# Altium schematic sheet 14.RK3588_USB30_USB20_Ctrl.SchDoc
size 420 x 297 mm; Revision: V2.1; Schematic Page Number: 11; Page Number: 14; Check: <Checker>; Schematic Name: RK_NVR_DEMO1_RK3588_LP4/4x_V21; Page Count: 43; Page name: 14.RK3588_USB30/USB20_Ctrl; Designer: Zhangdz; Schematic Page Count: 99; Revcode: V2.1; DsnPath: E:\Work\SBER\RK3588_SOM\temp\RK_NVR_DEMO1_RK3588_LP4XD200P232SD8_V21_20211228.DSN; SchematicName: RK_NVR_DEMO1_RK3588_LP4/4x_V21; PageName: 14.RK3588_USB30/USB20_Ctrl; PageSize: A3; TopSchematic: True
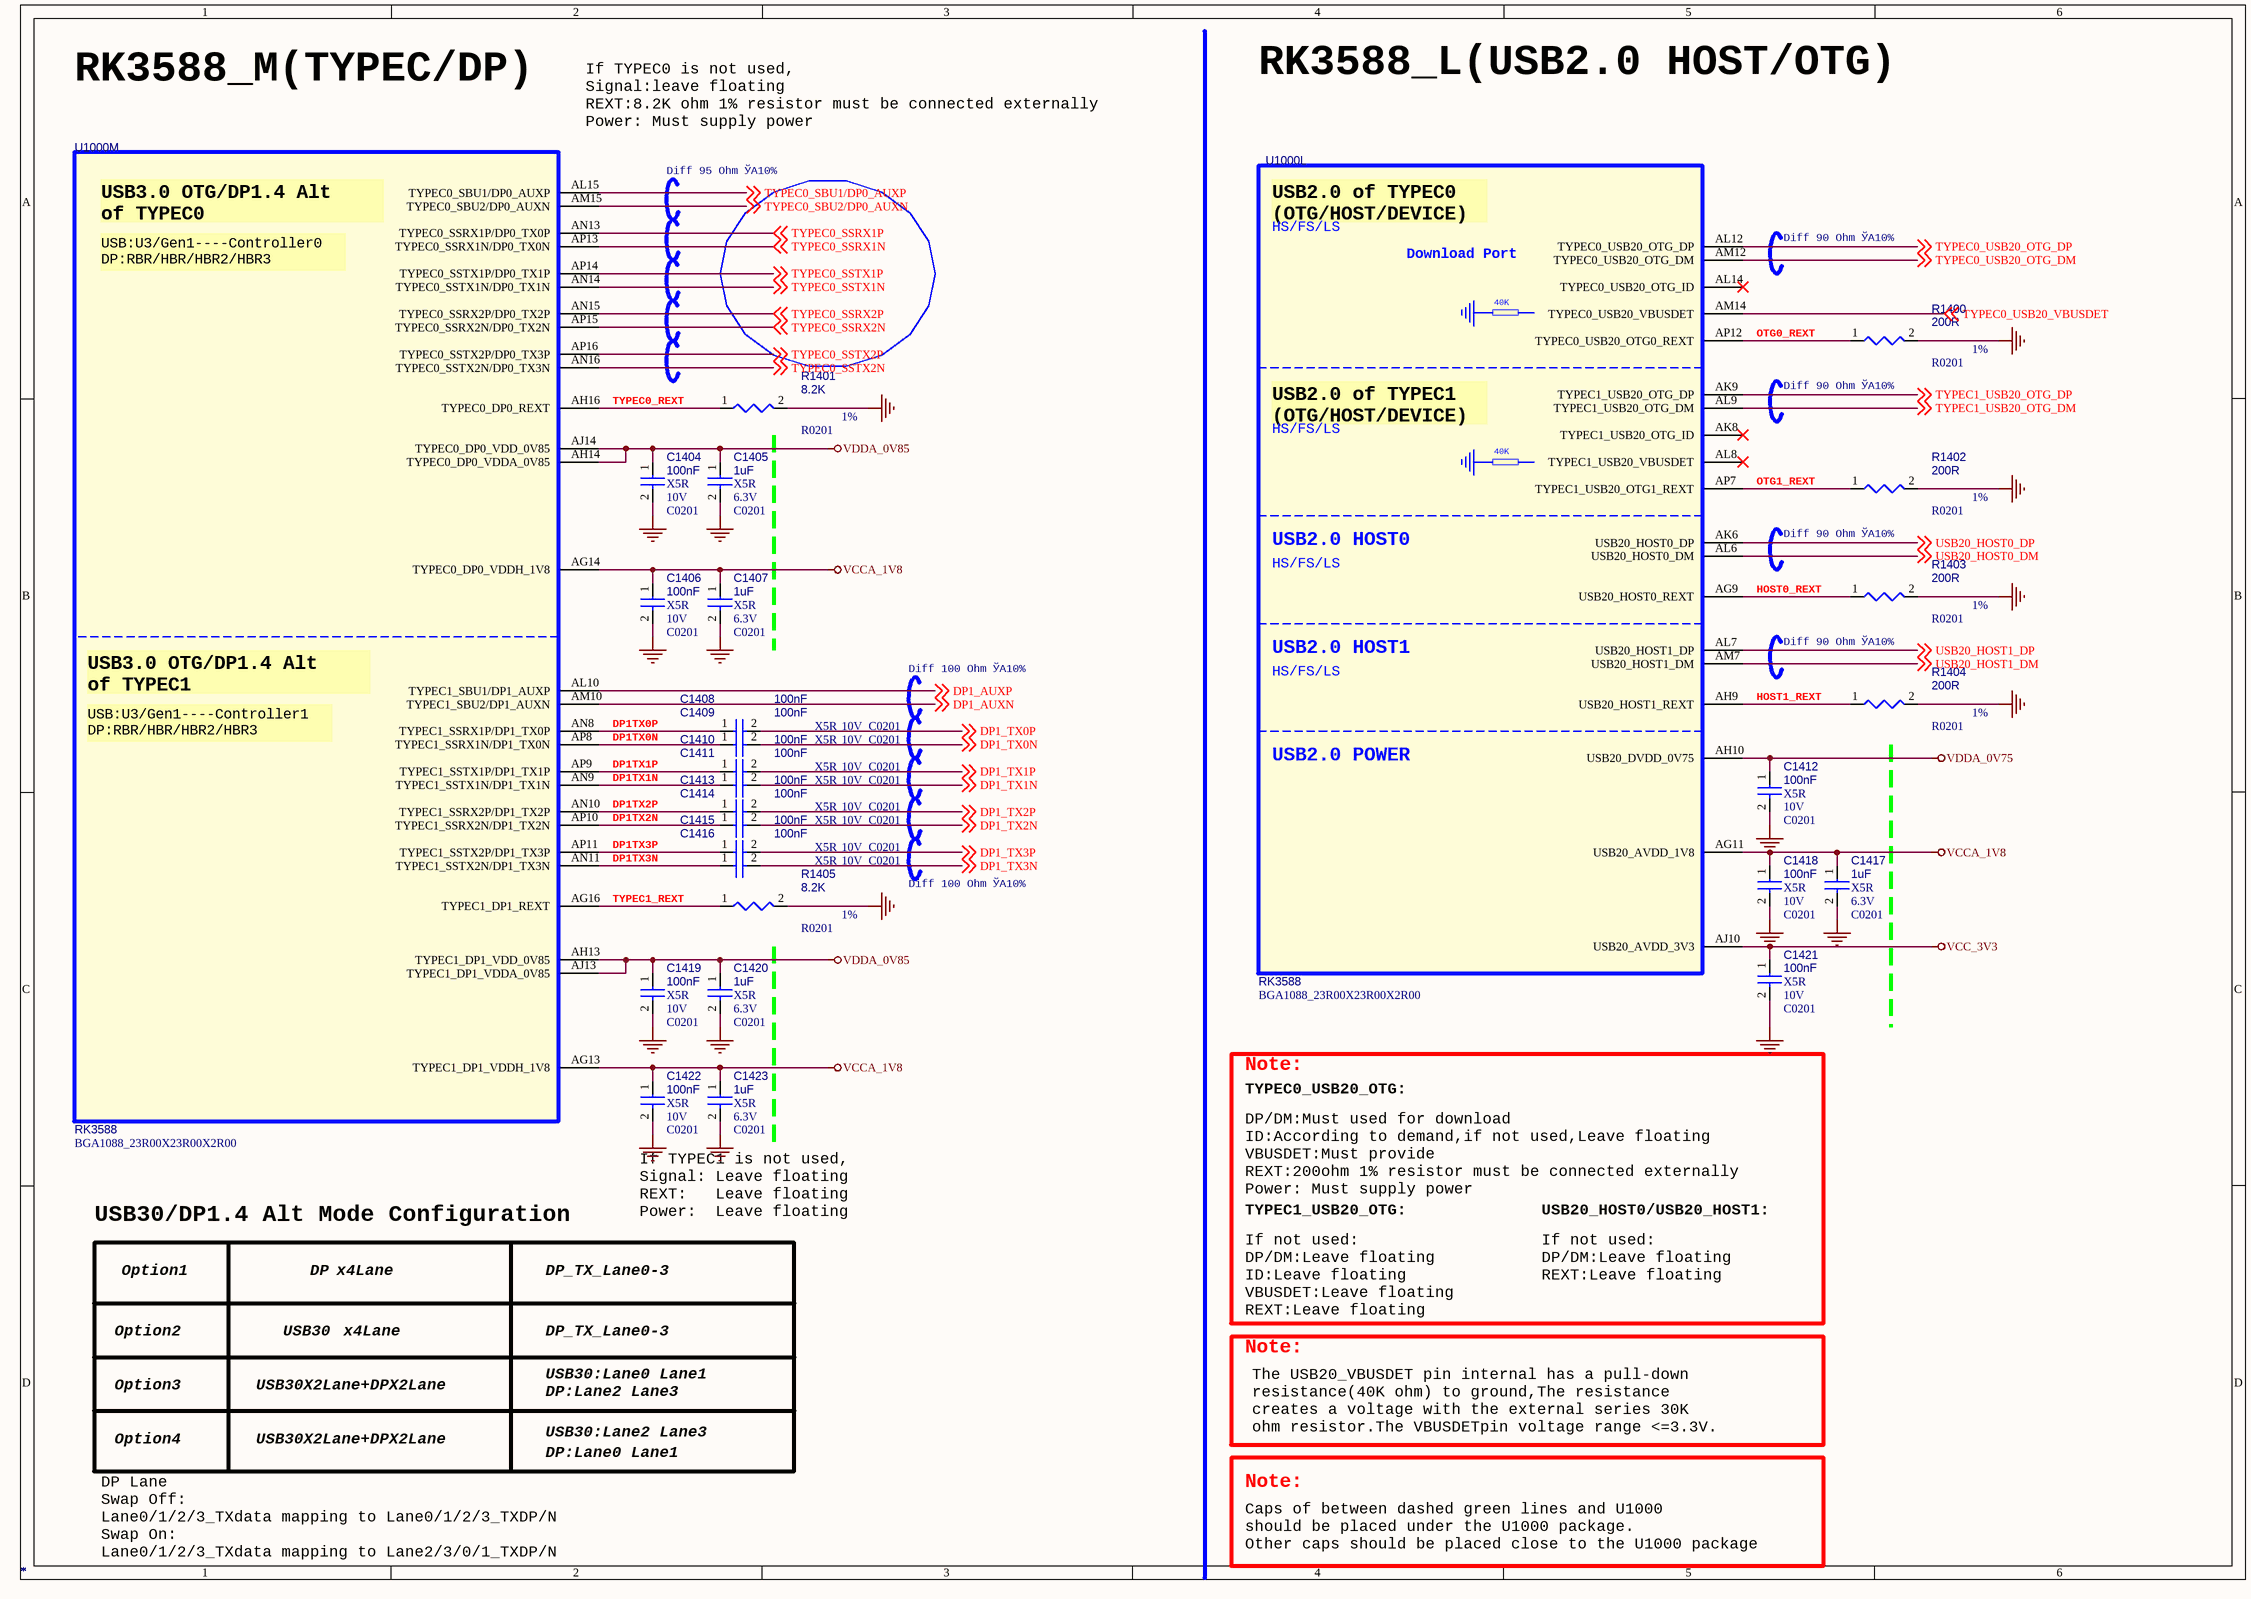
[diagram p0: 14.RK3588_USB30_USB20_Ctrl.SchDoc]

## Parts
C1404  *  Voltage: 10V  Dielectric: X5R  [C0201]
C1405  *  Voltage: 6.3V  Dielectric: X5R  [C0201]
C1406  *  Voltage: 10V  Dielectric: X5R  [C0201]
C1407  *  Voltage: 6.3V  Dielectric: X5R  [C0201]
C1408  *  Voltage: 10V  Dielectric: X5R  [C0201]
C1409  *  Voltage: 10V  Dielectric: X5R  [C0201]
C1410  *  Voltage: 10V  Dielectric: X5R  [C0201]
C1411  *  Voltage: 10V  Dielectric: X5R  [C0201]
C1412  *  Voltage: 10V  Dielectric: X5R  [C0201]
C1413  *  Voltage: 10V  Dielectric: X5R  [C0201]
C1414  *  Voltage: 10V  Dielectric: X5R  [C0201]
C1415  *  Voltage: 10V  Dielectric: X5R  [C0201]
C1416  *  Voltage: 10V  Dielectric: X5R  [C0201]
C1417  *  Voltage: 6.3V  Dielectric: X5R  [C0201]
C1418  *  Voltage: 10V  Dielectric: X5R  [C0201]
C1419  *  Voltage: 10V  Dielectric: X5R  [C0201]
C1420  *  Voltage: 6.3V  Dielectric: X5R  [C0201]
C1421  *  Voltage: 10V  Dielectric: X5R  [C0201]
C1422  *  Voltage: 10V  Dielectric: X5R  [C0201]
C1423  *  Voltage: 6.3V  Dielectric: X5R  [C0201]
R1400  *  PCB Footprint: R0201  Tolerance: 1%  [R0402]
R1401  *  PCB Footprint: R0201  Tolerance: 1%  [R0402]
R1402  *  PCB Footprint: R0201  Tolerance: 1%  [R0402]
R1403  *  PCB Footprint: R0201  Tolerance: 1%  [R0402]
R1404  *  PCB Footprint: R0201  Tolerance: 1%  [R0402]
R1405  *  PCB Footprint: R0201  Tolerance: 1%  [R0402]
U1000  *  [BGA1088_23R00X23R00X2R00]  (parts L,M of 26)

## Nets
GND: C1404.2 C1405.2 C1406.2 C1407.2 C1412.2 C1417.2 C1418.2 C1419.2 C1420.2 C1421.2 C1422.2 C1423.2 R1400.2 R1401.2 R1402.2 R1403.2 R1404.2 R1405.2
VCC_3V3: C1421.1 U1000.AJ10(USB20_AVDD_3V3)
VCCA_1V8: C1406.1 C1407.1 C1417.1 C1418.1 C1422.1 C1423.1 U1000.AG11(USB20_AVDD_1V8) U1000.AG13(TYPEC1_DP1_VDDH_1V8) U1000.AG14(TYPEC0_DP0_VDDH_1V8)
VDDA_0V75: C1412.1 U1000.AH10(USB20_DVDD_0V75)
VDDA_0V85: C1404.1 C1405.1 C1419.1 C1420.1 U1000.AH13(TYPEC1_DP1_VDD_0V85) U1000.AH14(TYPEC0_DP0_VDDA_0V85) U1000.AJ13(TYPEC1_DP1_VDDA_0V85) U1000.AJ14(TYPEC0_DP0_VDD_0V85)
DP1_AUXN: U1000.AM10(TYPEC1_SBU2/DP1_AUXN) ; off-sheet DP1_AUXN
DP1_AUXP: U1000.AL10(TYPEC1_SBU1/DP1_AUXP) ; off-sheet DP1_AUXP
DP1_TX0N: C1409.2 ; off-sheet DP1_TX0N
DP1_TX0P: C1408.2 ; off-sheet DP1_TX0P
DP1_TX1N: C1411.2 ; off-sheet DP1_TX1N
DP1_TX1P: C1410.2 ; off-sheet DP1_TX1P
DP1_TX2N: C1414.2 ; off-sheet DP1_TX2N
DP1_TX2P: C1413.2 ; off-sheet DP1_TX2P
DP1_TX3N: C1416.2 ; off-sheet DP1_TX3N
DP1_TX3P: C1415.2 ; off-sheet DP1_TX3P
DP1TX0N: C1409.1 U1000.AP8(TYPEC1_SSRX1N/DP1_TX0N)
DP1TX0P: C1408.1 U1000.AN8(TYPEC1_SSRX1P/DP1_TX0P)
DP1TX1N: C1411.1 U1000.AN9(TYPEC1_SSTX1N/DP1_TX1N)
DP1TX1P: C1410.1 U1000.AP9(TYPEC1_SSTX1P/DP1_TX1P)
DP1TX2N: C1414.1 U1000.AP10(TYPEC1_SSRX2N/DP1_TX2N)
DP1TX2P: C1413.1 U1000.AN10(TYPEC1_SSRX2P/DP1_TX2P)
DP1TX3N: C1416.1 U1000.AN11(TYPEC1_SSTX2N/DP1_TX3N)
DP1TX3P: C1415.1 U1000.AP11(TYPEC1_SSTX2P/DP1_TX3P)
HOST0_REXT: R1403.1 U1000.AG9(USB20_HOST0_REXT)
HOST1_REXT: R1404.1 U1000.AH9(USB20_HOST1_REXT)
OTG0_REXT: R1400.1 U1000.AP12(TYPEC0_USB20_OTG0_REXT)
OTG1_REXT: R1402.1 U1000.AP7(TYPEC1_USB20_OTG1_REXT)
TYPEC0_REXT: R1401.1 U1000.AH16(TYPEC0_DP0_REXT)
TYPEC0_SBU1/DP0_AUXP: U1000.AL15(TYPEC0_SBU1/DP0_AUXP) ; off-sheet TYPEC0_SBU1/DP0_AUXP
TYPEC0_SBU2/DP0_AUXN: U1000.AM15(TYPEC0_SBU2/DP0_AUXN) ; off-sheet TYPEC0_SBU2/DP0_AUXN
TYPEC0_SSRX1N: U1000.AP13(TYPEC0_SSRX1N/DP0_TX0N) ; off-sheet TYPEC0_SSRX1N
TYPEC0_SSRX1P: U1000.AN13(TYPEC0_SSRX1P/DP0_TX0P) ; off-sheet TYPEC0_SSRX1P
TYPEC0_SSRX2N: U1000.AP15(TYPEC0_SSRX2N/DP0_TX2N) ; off-sheet TYPEC0_SSRX2N
TYPEC0_SSRX2P: U1000.AN15(TYPEC0_SSRX2P/DP0_TX2P) ; off-sheet TYPEC0_SSRX2P
TYPEC0_SSTX1N: U1000.AN14(TYPEC0_SSTX1N/DP0_TX1N) ; off-sheet TYPEC0_SSTX1N
TYPEC0_SSTX1P: U1000.AP14(TYPEC0_SSTX1P/DP0_TX1P) ; off-sheet TYPEC0_SSTX1P
TYPEC0_SSTX2N: U1000.AN16(TYPEC0_SSTX2N/DP0_TX3N) ; off-sheet TYPEC0_SSTX2N
TYPEC0_SSTX2P: U1000.AP16(TYPEC0_SSTX2P/DP0_TX3P) ; off-sheet TYPEC0_SSTX2P
TYPEC0_USB20_OTG_DM: U1000.AM12(TYPEC0_USB20_OTG_DM) ; off-sheet TYPEC0_USB20_OTG_DM
TYPEC0_USB20_OTG_DP: U1000.AL12(TYPEC0_USB20_OTG_DP) ; off-sheet TYPEC0_USB20_OTG_DP
TYPEC0_USB20_VBUSDET: U1000.AM14(TYPEC0_USB20_VBUSDET) ; off-sheet TYPEC0_USB20_VBUSDET
TYPEC1_REXT: R1405.1 U1000.AG16(TYPEC1_DP1_REXT)
TYPEC1_USB20_OTG_DM: U1000.AL9(TYPEC1_USB20_OTG_DM) ; off-sheet TYPEC1_USB20_OTG_DM
TYPEC1_USB20_OTG_DP: U1000.AK9(TYPEC1_USB20_OTG_DP) ; off-sheet TYPEC1_USB20_OTG_DP
USB20_HOST0_DM: U1000.AL6(USB20_HOST0_DM) ; off-sheet USB20_HOST0_DM
USB20_HOST0_DP: U1000.AK6(USB20_HOST0_DP) ; off-sheet USB20_HOST0_DP
USB20_HOST1_DM: U1000.AM7(USB20_HOST1_DM) ; off-sheet USB20_HOST1_DM
USB20_HOST1_DP: U1000.AL7(USB20_HOST1_DP) ; off-sheet USB20_HOST1_DP

Not connected (* = marked no-connect by the designer): U1000 AK8(TYPEC1_USB20_OTG_ID)* AL8(TYPEC1_USB20_VBUSDET)* AL14(TYPEC0_USB20_OTG_ID)*

## Notes on the sheet
- RK3588_M(TYPEC/DP)
- If TYPEC0 is not used,
  Signal:leave floating
  REXT:8.2K ohm 1% resistor must be connected externally
  Power: Must supply power
- RK3588_L(USB2.0 HOST/OTG)
- Diff 95 Ohm ЎА10%
- Diff 90 Ohm ЎА10%
- (near R1400) Diff 90 Ohm ЎА10%
- Diff 100 Ohm ЎА10%
- TYPEC0_USB20_OTG:
- Note:
- DP/DM:Must used for download
  ID:According to demand,if not used,Leave floating
  VBUSDET:Must provide
  REXT:200ohm 1% resistor must be connected externally
  Power: Must supply power
- USB30/DP1.4 Alt Mode Configuration
- If TYPEC1 is not used,
  Signal: Leave floating
  REXT:   Leave floating
  Power:  Leave floating
- TYPEC1_USB20_OTG:
- USB20_HOST0/USB20_HOST1:
- Option2
- Option1
- USB30
- DP
- x4Lane
- DP_TX_Lane0-3
- If not used:
  DP/DM:Leave floating
  ID:Leave floating
  VBUSDET:Leave floating
  REXT:Leave floating
- If not used:
  DP/DM:Leave floating
  REXT:Leave floating
- Option3
- USB30X2Lane+DPX2Lane
- USB30:Lane0 Lane1
- DP:Lane2 Lane3
- Option4
- USB30:Lane2 Lane3
- DP:Lane0 Lane1
- The USB20_VBUSDET pin internal has a pull-down
  resistance(40K ohm) to ground,The resistance
  creates a voltage with the external series 30K
  ohm resistor.The VBUSDETpin voltage range <=3.3V.
- DP Lane
  Swap Off:
  Lane0/1/2/3_TXdata mapping to Lane0/1/2/3_TXDP/N
  Swap On:
  Lane0/1/2/3_TXdata mapping to Lane2/3/0/1_TXDP/N
- Caps of between dashed green lines and U1000
  should be placed under the U1000 package.
  Other caps should be placed close to the U1000 package
- (in symbol SOC_RK3588, part L) USB2.0 of TYPEC0 / (OTG/HOST/DEVICE); HS/FS/LS; Download Port; 40K; USB2.0 of TYPEC1 / (OTG/HOST/DEVICE); USB2.0 HOST0; USB2.0 HOST1; USB2.0 POWER
- (in symbol SOC_RK3588, part M) USB3.0 OTG/DP1.4 Alt / of TYPEC0; USB:U3/Gen1----Controller0 / DP:RBR/HBR/HBR2/HBR3; USB3.0 OTG/DP1.4 Alt / of TYPEC1; USB:U3/Gen1----Controller1 / DP:RBR/HBR/HBR2/HBR3

## Library data of the parts
C1404 = CAP NP: cap,100.00nF,+/-10%,10V,X5R,C0201; Part Reference: C1404; Manufacturer: TDK; Value: 100nF; RK PN: C0603X5R1A104K030BC; Priority: A; Tolerance: 10%; PCB Footprint: C0201; Part Type: C0201; Manufacturer PN: C0603X5R1A104K030BC; Created by: JJJ
C1405 = CAP NP: cap,1.00uF,+/-20%,6.3V,X5R,C0201; Part Reference: C1405; Manufacturer PN: C0603X5R0J105M030BC; Manufacturer: TDK; Value: 1uF; Tolerance: 20%; Priority: A; PCB Footprint: C0201; Created by: JJJ; Part Type: C0201; RK PN: C0603X5R0J105M030BC
C1406 = CAP NP: cap,100.00nF,+/-10%,10V,X5R,C0201; Part Reference: C1406; Manufacturer: TDK; Value: 100nF; RK PN: C0603X5R1A104K030BC; Priority: A; Tolerance: 10%; PCB Footprint: C0201; Part Type: C0201; Manufacturer PN: C0603X5R1A104K030BC; Created by: JJJ
C1407 = CAP NP: cap,1.00uF,+/-20%,6.3V,X5R,C0201; Part Reference: C1407; Manufacturer PN: C0603X5R0J105M030BC; Manufacturer: TDK; Value: 1uF; Tolerance: 20%; Priority: A; PCB Footprint: C0201; Created by: JJJ; Part Type: C0201; RK PN: C0603X5R0J105M030BC
C1408 = CAP NP: cap,100.00nF,+/-10%,10V,X5R,C0201; Part Reference: C1408; Manufacturer: TDK; Value: 100nF; RK PN: C0603X5R1A104K030BC; Priority: A; Tolerance: 10%; PCB Footprint: C0201; Part Type: C0201; Manufacturer PN: C0603X5R1A104K030BC; Created by: JJJ
C1409 = CAP NP: cap,100.00nF,+/-10%,10V,X5R,C0201; Part Reference: C1409; Manufacturer PN: C0603X5R1A104K030BC; Manufacturer: TDK; Value: 100nF; Tolerance: 10%; Priority: A; PCB Footprint: C0201; Created by: JJJ; Part Type: C0201; RK PN: C0603X5R1A104K030BC
C1410 = CAP NP: cap,100.00nF,+/-10%,10V,X5R,C0201; Part Reference: C1410; Manufacturer: TDK; Value: 100nF; RK PN: C0603X5R1A104K030BC; Priority: A; Tolerance: 10%; PCB Footprint: C0201; Part Type: C0201; Manufacturer PN: C0603X5R1A104K030BC; Created by: JJJ
C1411 = CAP NP: cap,100.00nF,+/-10%,10V,X5R,C0201; Part Reference: C1411; Manufacturer PN: C0603X5R1A104K030BC; Manufacturer: TDK; Value: 100nF; Tolerance: 10%; Priority: A; PCB Footprint: C0201; Created by: JJJ; Part Type: C0201; RK PN: C0603X5R1A104K030BC
C1412 = CAP NP: cap,100.00nF,+/-10%,10V,X5R,C0201; Part Reference: C1412; Manufacturer PN: C0603X5R1A104K030BC; Manufacturer: TDK; Value: 100nF; Tolerance: 10%; Priority: A; PCB Footprint: C0201; Created by: JJJ; Part Type: C0201; RK PN: C0603X5R1A104K030BC
C1413 = CAP NP: cap,100.00nF,+/-10%,10V,X5R,C0201; Part Reference: C1413; Manufacturer: TDK; Value: 100nF; RK PN: C0603X5R1A104K030BC; Priority: A; Tolerance: 10%; PCB Footprint: C0201; Part Type: C0201; Manufacturer PN: C0603X5R1A104K030BC; Created by: JJJ
C1414 = CAP NP: cap,100.00nF,+/-10%,10V,X5R,C0201; Part Reference: C1414; Manufacturer PN: C0603X5R1A104K030BC; Manufacturer: TDK; Value: 100nF; Tolerance: 10%; Priority: A; PCB Footprint: C0201; Created by: JJJ; Part Type: C0201; RK PN: C0603X5R1A104K030BC
C1415 = CAP NP: cap,100.00nF,+/-10%,10V,X5R,C0201; Part Reference: C1415; Manufacturer: TDK; Value: 100nF; RK PN: C0603X5R1A104K030BC; Priority: A; Tolerance: 10%; PCB Footprint: C0201; Part Type: C0201; Manufacturer PN: C0603X5R1A104K030BC; Created by: JJJ
C1416 = CAP NP: cap,100.00nF,+/-10%,10V,X5R,C0201; Part Reference: C1416; Manufacturer PN: C0603X5R1A104K030BC; Manufacturer: TDK; Value: 100nF; Tolerance: 10%; Priority: A; PCB Footprint: C0201; Created by: JJJ; Part Type: C0201; RK PN: C0603X5R1A104K030BC
C1417 = CAP NP: cap,1.00uF,+/-20%,6.3V,X5R,C0201; Part Reference: C1417; Manufacturer: TDK; Value: 1uF; RK PN: C0603X5R0J105M030BC; Priority: A; Tolerance: 20%; PCB Footprint: C0201; Part Type: C0201; Manufacturer PN: C0603X5R0J105M030BC; Created by: JJJ
C1418 = CAP NP: cap,100.00nF,+/-10%,10V,X5R,C0201; Part Reference: C1418; Manufacturer PN: C0603X5R1A104K030BC; Manufacturer: TDK; Value: 100nF; Tolerance: 10%; Priority: A; PCB Footprint: C0201; Created by: JJJ; Part Type: C0201; RK PN: C0603X5R1A104K030BC
C1419 = CAP NP: cap,100.00nF,+/-10%,10V,X5R,C0201; Part Reference: C1419; Manufacturer: TDK; Value: 100nF; RK PN: C0603X5R1A104K030BC; Priority: A; Tolerance: 10%; PCB Footprint: C0201; Part Type: C0201; Manufacturer PN: C0603X5R1A104K030BC; Created by: JJJ
C1420 = CAP NP: cap,1.00uF,+/-20%,6.3V,X5R,C0201; Part Reference: C1420; Manufacturer PN: C0603X5R0J105M030BC; Manufacturer: TDK; Value: 1uF; Tolerance: 20%; Priority: A; PCB Footprint: C0201; Created by: JJJ; Part Type: C0201; RK PN: C0603X5R0J105M030BC
C1421 = CAP NP: cap,100.00nF,+/-10%,10V,X5R,C0201; Part Reference: C1421; Manufacturer PN: C0603X5R1A104K030BC; Manufacturer: TDK; Value: 100nF; Tolerance: 10%; Priority: A; PCB Footprint: C0201; Created by: JJJ; Part Type: C0201; RK PN: C0603X5R1A104K030BC
C1422 = CAP NP: cap,100.00nF,+/-10%,10V,X5R,C0201; Part Reference: C1422; Manufacturer: TDK; Value: 100nF; RK PN: C0603X5R1A104K030BC; Priority: A; Tolerance: 10%; PCB Footprint: C0201; Part Type: C0201; Manufacturer PN: C0603X5R1A104K030BC; Created by: JJJ
C1423 = CAP NP: cap,1.00uF,+/-20%,6.3V,X5R,C0201; Part Reference: C1423; Manufacturer PN: C0603X5R0J105M030BC; Manufacturer: TDK; Value: 1uF; Tolerance: 20%; Priority: A; PCB Footprint: C0201; Created by: JJJ; Part Type: C0201; RK PN: C0603X5R0J105M030BC
R1400 = RESISTOR_Dup1: НЁУГєсД¤µзЧи,200R,+/-1%,R0201,1/20W.; Part Reference: R1400; Manufacturer PN: RC0201FR-07200RL; Manufacturer: YAGEO; Wattage: 1/20W; Priority: A; Value: 200R; Created by: YTL; Part Type: НЁУГєсД¤µзЧи; RK PN: RC0201FR-07200RL
R1401 = RESISTOR_Dup1: НЁУГєсД¤µзЧи,8K2,+/-1%,R0201,1/20W.; Part Reference: R1401; Manufacturer: YAGEO; Value: 8.2K; RK PN: RC0201FR-078K2L; Priority: A; Wattage: 1/20W; Part Type: НЁУГєсД¤µзЧи; Manufacturer PN: RC0201FR-078K2L; Created by: YTL
R1402 = RESISTOR_Dup1: НЁУГєсД¤µзЧи,200R,+/-1%,R0201,1/20W.; Part Reference: R1402; Manufacturer PN: RC0201FR-07200RL; Manufacturer: YAGEO; Wattage: 1/20W; Priority: A; Value: 200R; Created by: YTL; Part Type: НЁУГєсД¤µзЧи; RK PN: RC0201FR-07200RL
R1403 = RESISTOR_Dup1: НЁУГєсД¤µзЧи,200R,+/-1%,R0201,1/20W.; Part Reference: R1403; Manufacturer PN: RC0201FR-07200RL; Manufacturer: YAGEO; Wattage: 1/20W; Priority: A; Value: 200R; Created by: YTL; Part Type: НЁУГєсД¤µзЧи; RK PN: RC0201FR-07200RL
R1404 = RESISTOR_Dup1: НЁУГєсД¤µзЧи,200R,+/-1%,R0201,1/20W.; Part Reference: R1404; Manufacturer PN: RC0201FR-07200RL; Manufacturer: YAGEO; Wattage: 1/20W; Priority: A; Value: 200R; Created by: YTL; Part Type: НЁУГєсД¤µзЧи; RK PN: RC0201FR-07200RL
R1405 = RESISTOR_Dup1: НЁУГєсД¤µзЧи,8K2,+/-1%,R0201,1/20W.; Part Reference: R1405; Manufacturer: YAGEO; Value: 8.2K; RK PN: RC0201FR-078K2L; Priority: A; Wattage: 1/20W; Part Type: НЁУГєсД¤µзЧи; Manufacturer PN: RC0201FR-078K2L; Created by: YTL
U1000 = SOC_RK3588: ROCKCHIP SOC; Part Reference: U1000; Manufacturer: Rockchip (ИрРѕОў); SPLIT_INST: TRUE; SWAP_INFO: (S1+S2+S3+S4+S5+S6+S7+S8+S9+S10+S11+S12+S13+S14+S15+S16+S17+S18+S19+S20+S21+S22+S23+S24+S25+S26); Value: RK3588; Priority: A; Created by: YWQ; Manufacturer PN: RK3588; Part Type: SOC; RK PN: RK3588; PCB Footprint: BGA1088_23R00X23R00X2R00